# EAGLE schematic Battery Segment (EAGLE 9.5.0)
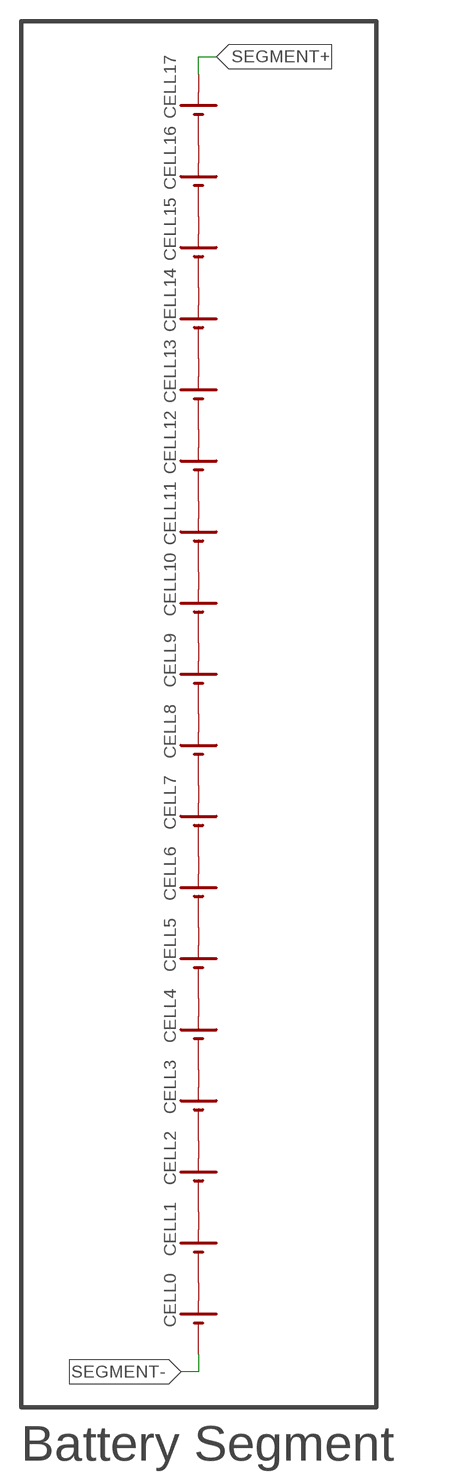
[diagram p0: schematic, sheet 1]

## Parts
CELL0  BATTERY_1_CELL  (no package)
CELL1  BATTERY_1_CELL  (no package)
CELL2  BATTERY_1_CELL  (no package)
CELL3  BATTERY_1_CELL  (no package)
CELL4  BATTERY_1_CELL  (no package)
CELL5  BATTERY_1_CELL  (no package)
CELL6  BATTERY_1_CELL  (no package)
CELL7  BATTERY_1_CELL  (no package)
CELL8  BATTERY_1_CELL  (no package)
CELL9  BATTERY_1_CELL  (no package)
CELL10  BATTERY_1_CELL  (no package)
CELL11  BATTERY_1_CELL  (no package)
CELL12  BATTERY_1_CELL  (no package)
CELL13  BATTERY_1_CELL  (no package)
CELL14  BATTERY_1_CELL  (no package)
CELL15  BATTERY_1_CELL  (no package)
CELL16  BATTERY_1_CELL  (no package)
CELL17  BATTERY_1_CELL  (no package)

## Nets
N$1: CELL0.+ CELL1.-
N$2: CELL1.+ CELL2.-
N$3: CELL2.+ CELL3.-
N$4: CELL3.+ CELL4.-
N$5: CELL4.+ CELL5.-
N$6: CELL5.+ CELL6.-
N$7: CELL6.+ CELL7.-
N$8: CELL7.+ CELL8.-
N$9: CELL8.+ CELL9.-
N$10: CELL9.+ CELL10.-
N$11: CELL10.+ CELL11.-
N$12: CELL11.+ CELL12.-
N$13: CELL12.+ CELL13.-
N$14: CELL13.+ CELL14.-
N$15: CELL14.+ CELL15.-
N$16: CELL15.+ CELL16.-
N$17: CELL16.+ CELL17.-
SEGMENT+: CELL17.+
SEGMENT-: CELL0.-

## Notes on the sheet
- Battery Segment

## Library data of the parts
CELL0 CELL1-CELL17 = HyTechSymbols:BATTERY_1_CELL: Generic 1-cell battery Source: Sonnenschein